# EAGLE design LB_BIT_w6_ARDUINO-v03(4-5)OHW (EAGLE 6.6.0)

## Sheet 1 of 2: micro
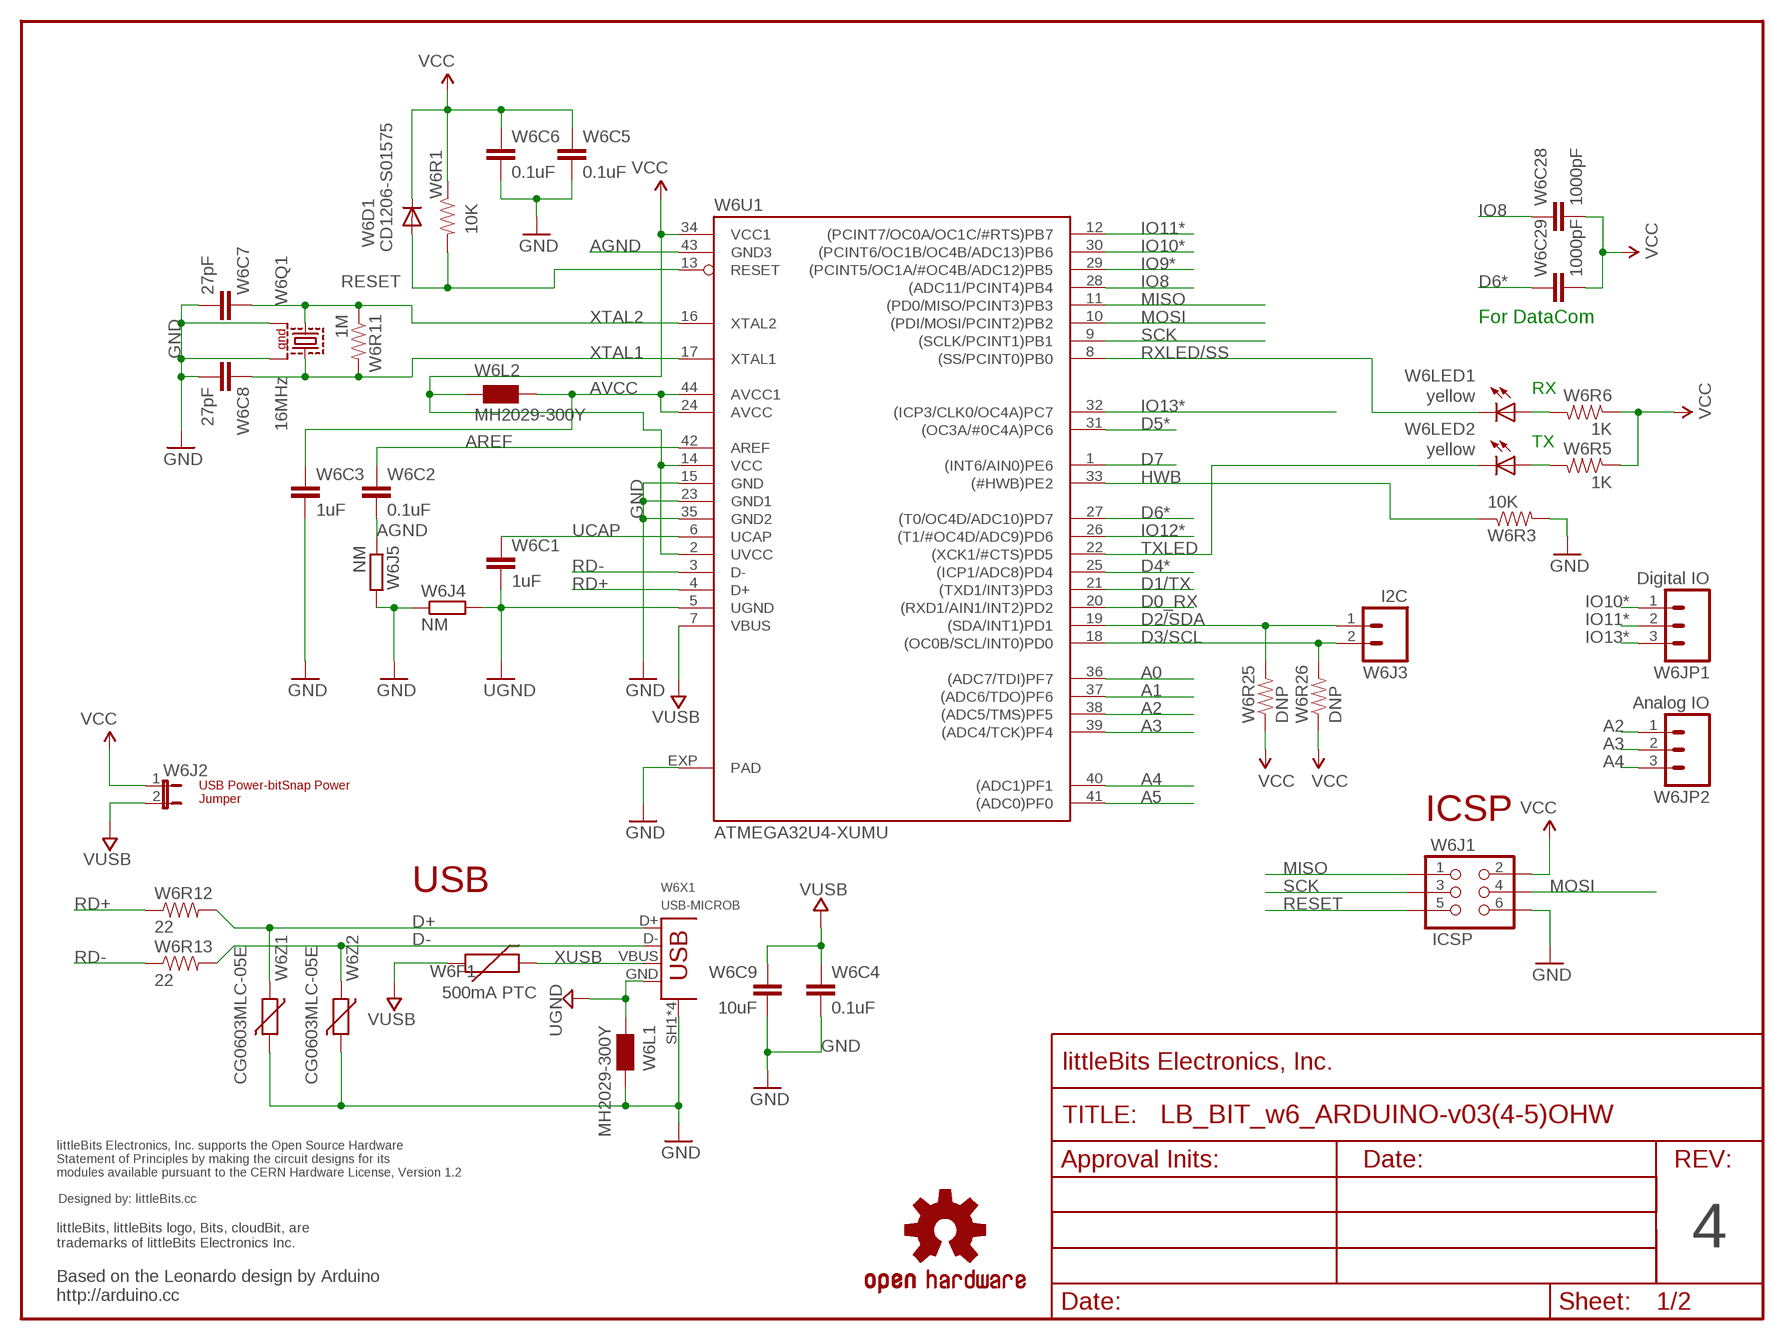
[diagram p0: schematic, sheet 1]

### Parts
FRAME2  FRAME-LETTER-OHWOHW  [FABDWG01-OHW]
U$52  OSHW-LOGOL  [OSHW-LOGO-L]
U$67  OSHWCREDIT  [OSHWCREDIT]
W6C1  1uF  CAPCAP-0603  [CAP-0603]
W6C2  0.1uF  CAPCAP-0603  [CAP-0603]
W6C3  1uF  CAPCAP-0603  [CAP-0603]
W6C4  0.1uF  CAPCAP-0603  [CAP-0603]
W6C5  0.1uF  CAPCAP-0603  [CAP-0603]
W6C6  0.1uF  CAPCAP-0603  [CAP-0603]
W6C7  27pF  CAPCAP-0603  [CAP-0603]
W6C8  27pF  CAPCAP-0603  [CAP-0603]
W6C9  10uF  CAPCAP-0805  [CAP-0805]
W6C28  1000pF  CAPCAP-0603  [CAP-0603]
W6C29  1000pF  CAPCAP-0603  [CAP-0603]
W6D1  CD1206-S01575  DIODE-MINIMELF  [MINIMELF]
W6F1  500mA PTC  PTC  [PTC-1206]
W6J1  ICSP  HDR-2X3  [2X03]
W6J2  JUMPER-2SMD-NO  [SJ_2S-NO]
W6J3  I2C  HDR-20.1IN_NOS.S.  [SIP2-SM-0.1IN]
W6J4  NM  R-EU_R0402  [R0402]
W6J5  NM  R-EU_R0402  [R0402]
W6JP1  Digital IO  M03PTH  [1X03]
W6JP2  Analog IO  M03PTH  [1X03]
W6L1  MH2029-300Y  WE-CBF_0805  [0805]
W6L2  MH2029-300Y  WE-CBF_0805  [0805]
W6LED1  yellow  LED1206  [LED-1206]
W6LED2  yellow  LED1206  [LED-1206]
W6Q1  16MHz  CRYSTAL-SMD-7B-SERIES-TXC  [CRYSTAL-SMD-7B-SERIES-5X3.2MM]
W6R1  10K  RESISTOR0603  [RES-0603]
W6R3  10K  RESISTOR0603  [RES-0603]
W6R5  1K  RESISTOR0603  [RES-0603]
W6R6  1K  RESISTOR0603  [RES-0603]
W6R11  1M  RESISTOR0603  [RES-0603]
W6R12  22  RESISTOR0603  [RES-0603]
W6R13  22  RESISTOR0603  [RES-0603]
W6R25  DNP  RESISTOR0603  [RES-0603]
W6R26  DNP  RESISTOR0603  [RES-0603]
W6U1  ATMEGA32U4-XUMU  [QFN44ML7X7]
W6X1  USB-MICROB  USB-MICROB-DRILLS  [USB-MICROB-AUK-DRILLS]
W6Z1  CG0603MLC-05E  VARISTORCN0603  [CT/CN0603]
W6Z2  CG0603MLC-05E  VARISTORCN0603  [CT/CN0603]

### Nets
A0: W6U1.36((ADC7/TDI)PF7) ; also sheet 2
A1: W6U1.37((ADC6/TDO)PF6) ; also sheet 2
A2: W6JP2.1 W6U1.38((ADC5/TMS)PF5)
A3: W6JP2.2 W6U1.39((ADC4/TCK)PF4)
A4: W6JP2.3 W6U1.40((ADC1)PF1)
A5: W6U1.41((ADC0)PF0)
AGND: W6C2.2 W6J5.1 W6U1.43(GND3)
AREF: W6C2.1 W6U1.42(AREF)
AVCC: W6C3.1 W6L2.2 W6U1.24(AVCC) W6U1.44(AVCC1)
D0_RX: W6U1.20((RXD1/AIN1/INT2)PD2) ; also sheet 2
D1/TX: W6U1.21((TXD1/INT3)PD3) ; also sheet 2
D2/SDA: W6J3.1 W6R25.2 W6U1.19((SDA/INT1)PD1)
D3/SCL: W6J3.2 W6R26.2 W6U1.18((OC0B/SCL/INT0)PD0)
D4*: W6U1.25((ICP1/ADC8)PD4)
D5*: W6U1.31((OC3A/#0C4A)PC6) ; also sheet 2
D6*: W6C29.1 W6U1.27((T0/OC4D/ADC10)PD7)
D7: W6U1.1((INT6/AIN0)PE6)
D+: W6R12.2 W6X1.D+ W6Z1.1
D-: W6R13.2 W6X1.D- W6Z2.1
GND: W6C3.2 W6C4.2 W6C5.2 W6C6.2 W6C7.2 W6C8.2 W6C9.2 W6J1.6 W6J4.1 W6J5.2 W6L1.2 W6Q1.P$2 W6Q1.P$4 W6R3.2 W6U1.15(GND) W6U1.23(GND1) W6U1.35(GND2) W6U1.EXP(PAD) W6X1.SH1(SH) W6X1.SH2(SH) W6X1.SH3(SH) W6X1.SH4(SH) W6Z1.2 W6Z2.2 ; also sheet 2
HWB: W6R3.1 W6U1.33((#HWB)PE2)
IO8: W6C28.1 W6U1.28((ADC11/PCINT4)PB4)
IO9*: W6U1.29((PCINT5/OC1A/#OC4B/ADC12)PB5) ; also sheet 2
IO10*: W6JP1.1 W6U1.30((PCINT6/OC1B/OC4B/ADC13)PB6)
IO11*: W6JP1.2 W6U1.12((PCINT7/OC0A/OC1C/#RTS)PB7)
IO12*: W6U1.26((T1/#OC4D/ADC9)PD6)
IO13*: W6JP1.3 W6U1.32((ICP3/CLK0/OC4A)PC7)
MISO: W6J1.1 W6U1.11((PD0/MISO/PCINT3)PB3)
MOSI: W6J1.4 W6U1.10((PDI/MOSI/PCINT2)PB2)
N$1: W6LED1.A W6R6.2
N$2: W6LED2.A W6R5.2
RD+: W6R12.1 W6U1.4(D+)
RD-: W6R13.1 W6U1.3(D-)
RESET: W6D1.A W6J1.5 W6R1.2 W6U1.13(RESET)
RXLED/SS: W6LED1.C W6U1.8((SS/PCINT0)PB0)
SCK: W6J1.3 W6U1.9((SCLK/PCINT1)PB1)
TXLED: W6LED2.C W6U1.22((XCK1/#CTS)PD5)
UCAP: W6C1.1 W6U1.6(UCAP)
UGND: W6C1.2 W6J4.2 W6L1.1 W6U1.5(UGND) W6X1.GND
VCC: W6C5.1 W6C6.1 W6C28.2 W6C29.2 W6D1.C W6J1.2 W6J2.1 W6L2.1 W6R1.1 W6R5.1 W6R6.1 W6R25.1 W6R26.1 W6U1.2(UVCC) W6U1.14(VCC) W6U1.34(VCC1) ; also sheet 2
VUSB: W6C4.1 W6C9.1 W6F1.1 W6J2.2 W6U1.7(VBUS)
XTAL1: W6C8.1 W6Q1.P$3 W6R11.2 W6U1.17(XTAL1)
XTAL2: W6C7.1 W6Q1.P$1 W6R11.1 W6U1.16(XTAL2)
XUSB: W6F1.2 W6X1.VBUS

### Notes on the sheet
- For DataCom
- RX
- TX
- USB Power-bitSnap Power
  Jumper
- ICSP
- USB
- 4
- Based on the Leonardo design by Arduino
  http://arduino.cc

## Sheet 2 of 2: i/o filters
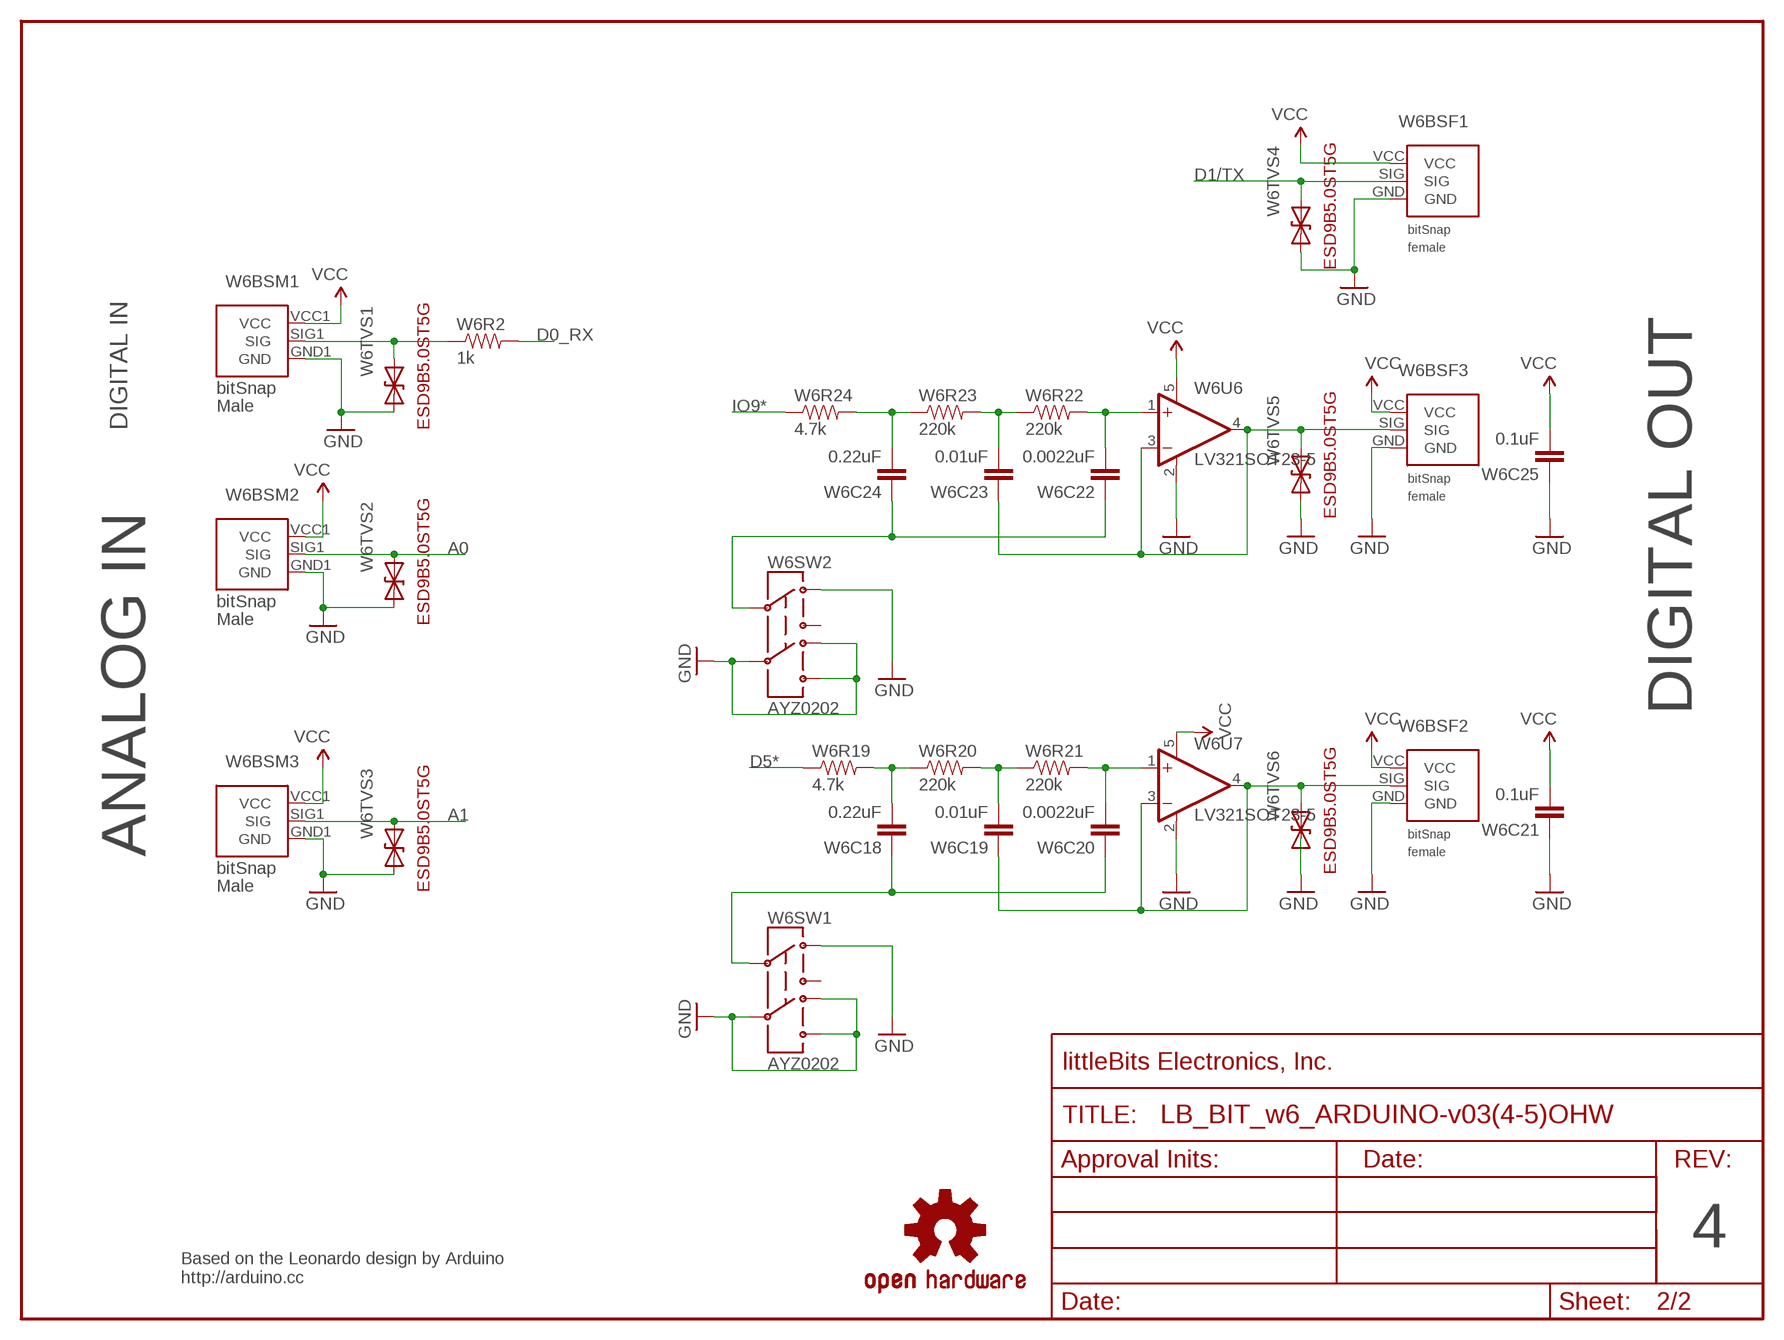
[diagram p1: schematic, sheet 2]

### Parts
U$54  FRAME-LETTER-OHWOHW  [FABDWG01-OHW]
U$70  OSHW-LOGOL  [OSHW-LOGO-L]
W6BSF1  BITSNAP_V03_FEMALE  [BITSNAP_V03_FEMALE]
W6BSF2  BITSNAP_V03_FEMALE  [BITSNAP_V03_FEMALE]
W6BSF3  BITSNAP_V03_FEMALE  [BITSNAP_V03_FEMALE]
W6BSM1  BITSNAP_V03_MALE  [BITSNAP_V03_MALE]
W6BSM2  BITSNAP_V03_MALE  [BITSNAP_V03_MALE]
W6BSM3  BITSNAP_V03_MALE  [BITSNAP_V03_MALE]
W6C18  0.22uF  CAPCAP-0603  [CAP-0603]
W6C19  0.01uF  CAPCAP-0603  [CAP-0603]
W6C20  0.0022uF  CAPCAP-0603  [CAP-0603]
W6C21  0.1uF  CAPCAP-0603  [CAP-0603]
W6C22  0.0022uF  CAPCAP-0603  [CAP-0603]
W6C23  0.01uF  CAPCAP-0603  [CAP-0603]
W6C24  0.22uF  CAPCAP-0603  [CAP-0603]
W6C25  0.1uF  CAPCAP-0603  [CAP-0603]
W6R2  1k  RESISTOR0603  [RES-0603]
W6R19  4.7k  RESISTOR0603  [RES-0603]
W6R20  220k  RESISTOR0603  [RES-0603]
W6R21  220k  RESISTOR0603  [RES-0603]
W6R22  220k  RESISTOR0603  [RES-0603]
W6R23  220k  RESISTOR0603  [RES-0603]
W6R24  4.7k  RESISTOR0603  [RES-0603]
W6SW1  AYZ0202  [AYZ0202]
W6SW2  AYZ0202  [AYZ0202]
W6TVS1  DIODE-TVSSOD-923  [SOD-923]
W6TVS2  DIODE-TVSSOD-923  [SOD-923]
W6TVS3  DIODE-TVSSOD-923  [SOD-923]
W6TVS4  DIODE-TVSSOD-923  [SOD-923]
W6TVS5  DIODE-TVSSOD-923  [SOD-923]
W6TVS6  DIODE-TVSSOD-923  [SOD-923]
W6U6  LV321SOT23-5  [SOT23-5]
W6U7  LV321SOT23-5  [SOT23-5]

### Nets
A0: W6BSM2.SIG1(SIG) W6TVS2.2(C) ; also sheet 1
A1: W6BSM3.SIG1(SIG) W6TVS3.2(C) ; also sheet 1
D0_RX: W6R2.2 ; also sheet 1
D1/TX: W6BSF1.SIG W6TVS4.2(C) ; also sheet 1
D5*: W6R19.1 ; also sheet 1
GND: W6BSF1.GND W6BSF2.GND W6BSF3.GND W6BSM1.GND1(GND) W6BSM2.GND1(GND) W6BSM3.GND1(GND) W6C21.1 W6C25.1 W6SW1.1 W6SW1.4 W6SW1.5 W6SW1.6 W6SW2.1 W6SW2.4 W6SW2.5 W6SW2.6 W6TVS1.1(A) W6TVS2.1(A) W6TVS3.1(A) W6TVS4.1(A) W6TVS5.1(A) W6TVS6.1(A) W6U6.2(V-) W6U7.2(V-) ; also sheet 1
IO9*: W6R24.1 ; also sheet 1
N$3: W6C18.1 W6C20.1 W6SW1.2
N$4: W6BSM1.SIG1(SIG) W6R2.1 W6TVS1.2(C)
N$13: W6C18.2 W6R19.2 W6R20.1
N$14: W6C19.2 W6R20.2 W6R21.1
N$15: W6C20.2 W6R21.2 W6U7.1(+IN)
N$16: W6BSF2.SIG W6C19.1 W6TVS6.2(C) W6U7.3(-IN) W6U7.4(OUT)
N$17: W6BSF3.SIG W6C23.1 W6TVS5.2(C) W6U6.3(-IN) W6U6.4(OUT)
N$18: W6C22.2 W6R22.2 W6U6.1(+IN)
N$19: W6C24.2 W6R23.1 W6R24.2
N$20: W6C23.2 W6R22.1 W6R23.2
N$23: W6C22.1 W6C24.1 W6SW2.2
VCC: W6BSF1.VCC W6BSF2.VCC W6BSF3.VCC W6BSM1.VCC1(VCC) W6BSM2.VCC1(VCC) W6BSM3.VCC1(VCC) W6C21.2 W6C25.2 W6U6.5(V+) W6U7.5(V+) ; also sheet 1
Unconnected: W6SW1.3 W6SW2.3

### Notes on the sheet
- DIGITAL IN
- DIGITAL OUT
- ANALOG IN
- 4
- Based on the Leonardo design by Arduino
  http://arduino.cc

## Library data of the parts
FRAME2 U$54 = LITTLEBITS:FRAME-LETTER-OHW
U$52 U$70 = LITTLEBITS:OSHW-LOGO: Open Source Hardware Logo This logo indicates the piece of hardware it is found on incorporates a OSHW license and/or adheres to the definition of open source hardware found here: http://freedomdefined.org/OSHW
U$67 = LITTLEBITS:OSHWCREDIT
W6BSF1-W6BSF3 = bitSnap:BITSNAP_V03_FEMALE
W6BSM1-W6BSM3 = bitSnap:BITSNAP_V03_MALE
W6C1-W6C9 W6C18-W6C25 W6C28 W6C29 = LITTLEBITS:CAP
W6D1 = diode:DIODE-: DIODE
W6F1 = LITTLEBITS:PTC
W6J1 = LITTLEBITS:HDR-2X3
W6J2 = LITTLEBITS:JUMPER-2: Jumper Basic 0.1" spaced jumper. Use with breakaway headers.
W6J3 = LITTLEBITS:HDR-2
W6J4 W6J5 = SmartPrj:R-EU_: RESISTOR, European symbol
W6JP1 W6JP2 = SparkFun:M03: Header 3 Standard 3-pin 0.1" header. Use with straight break away headers (SKU : PRT-00116), right angle break away headers (PRT-00553), swiss pins (PRT-00743), machine pins (PRT-00117), and female headers (PRT-00115). Molex polarized connector foot print use with SKU : PRT-08232 with associated crimp pins and housings.
W6L1 W6L2 = wuerth-elektronik:WE-CBF: SMD EMI Suppression Ferrite Beads - excellent anti-EMI properties - low DCR - impedances till 3000 ohms - rated current up to 6 A
W6LED1 W6LED2 = LITTLEBITS:LED
W6Q1 = LITTLEBITS:CRYSTAL-SMD-7B-SERIES-TXC; MFG: TXC; MPN: 7B SERIES
W6R1-W6R3 W6R5 W6R6 W6R11-W6R13 W6R19-W6R26 = LITTLEBITS:RESISTOR
W6SW1 W6SW2 = LITTLEBITS:AYZ0202
W6TVS1-W6TVS6 = LITTLEBITS:DIODE-TVS: Bidirectional Transient Voltage Suppression Diode: Device conducts in avalanche mode after reaching a part dependent voltage threshold. Used for limiting voltage spikes on ESD sensitive inputs and outputs.; IEC_ESD_PROT0: +/-18kV; LB_PN: ?; MPN: ESD9B5.0ST5G; V_CLAMP: ?; V_OPERATION: 5V
W6U1 = SmartPrj:ATMEGA32U4-XU
W6U6 W6U7 = LITTLEBITS:LV321
W6X1 = LITTLEBITS:USB-MICROB-DRILLS: AUK micro USB connector Part #: MCSB5ABSW-4-GXX-R1K-H; MFG: AUK; MPN: MCSB5ABSW-4-GXX-R1K-H
W6Z1 W6Z2 = varistor:VARISTOR: VARISTOR

## Net classes
0 default: width 0.254 mm, drill 0.61 mm, clearance 0.203 mm
1 vcc: width 0.254 mm

## Board
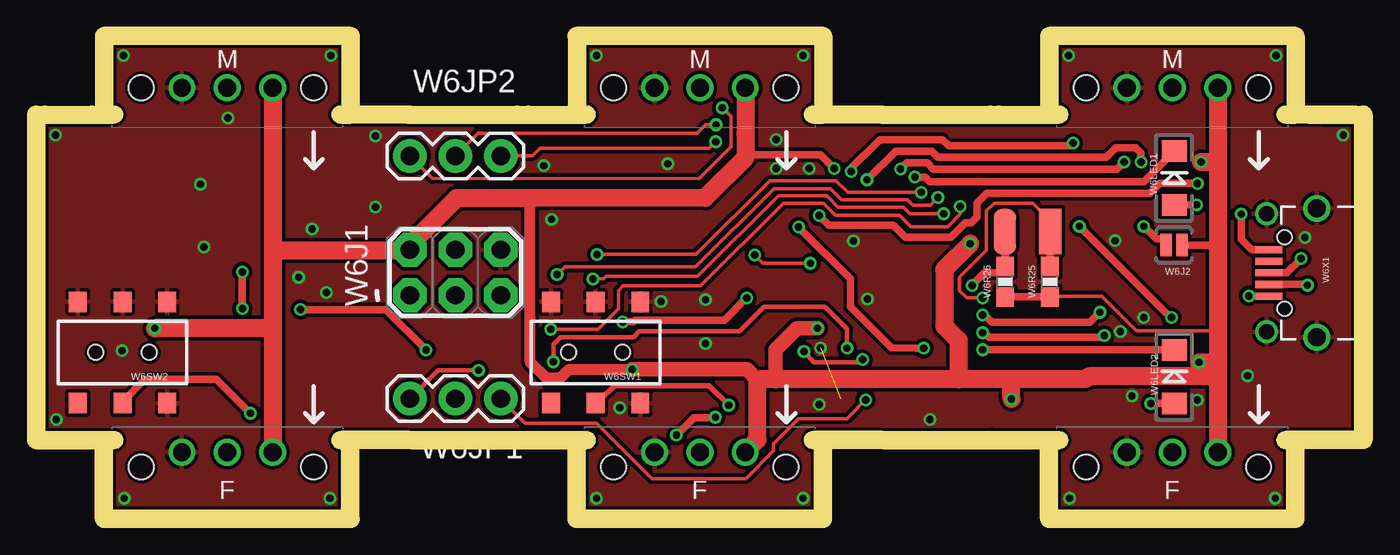
[diagram p2: board, top side]
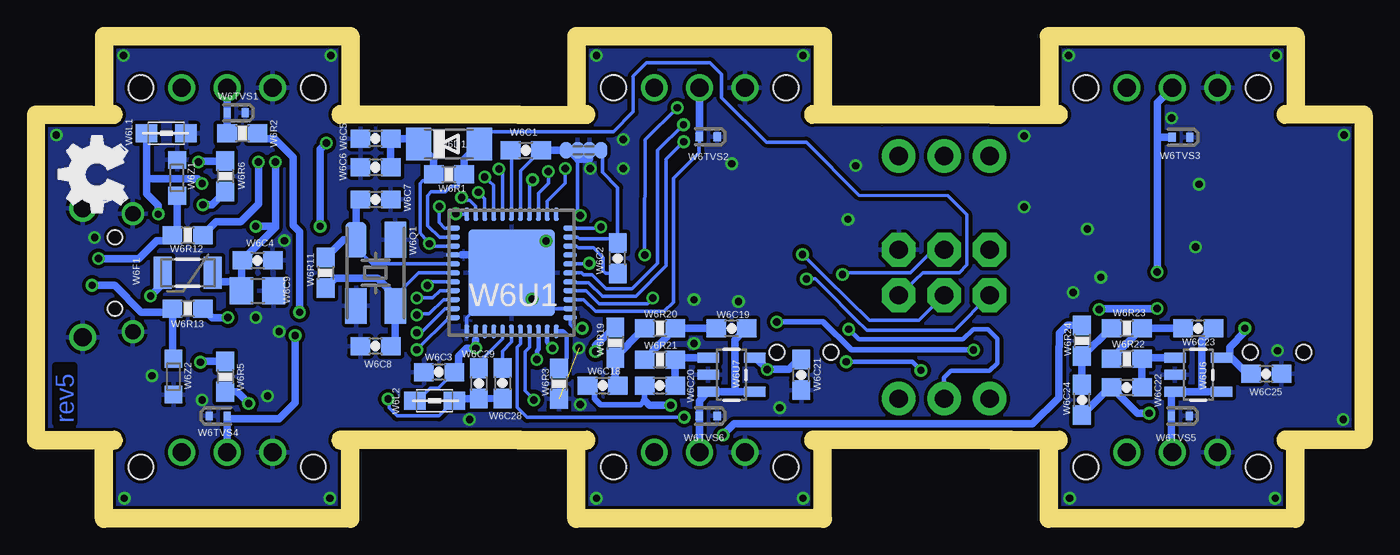
[diagram p3: board, bottom side, seen from below]

Size 73.25 x 26 mm. Coordinates in mm from the lower left corner, seen from the top.
Outline: 0,21.6 0,4.4 0.05,4.4
Outline: 73.25,4.4 73.25,21.6 71.45,21.6
Outline: 19.15,4.4 28.82,4.4
Outline: 46.6,4.4 53,4.4
Outline: 46.75,21.6 53.05,21.6
Outline: 20.35,21.6 26.45,21.6
Copper layers (1*16): Top 0.035mm / dielectric 1.5mm / Bottom 0.035mm
Design rules "littleBitsDRC": minimum track width 0.2mm, minimum drill 0.4mm, track to track 0.2mm, track to pad 0.2mm, pad to pad 0.2mm, via to via 0.2mm, smd to smd 0mil, copper to edge 0.2mm, drill to drill 0.2mm, minimum pad ring 0.2mm, minimum via ring 0.15mm, stop-mask expansion 0.1mm, vias tented up to drill 0mil, thermal gap 0.2mm
Milling: 10 lines

### Footprints (pad centres in the part's own frame; a part is rotated, then mirrored left to right if it is on the bottom)
BITSNAP_V03_FEMALE = drill 1: GND 4.065,3.44; SIG 6.605,3.44; VCC 9.145,3.44 | hole 1.4: 1.785,2.61; 11.425,2.61
BITSNAP_V03_MALE = drill 1: GND1 9.145,2.61; SIG1 6.605,2.61; VCC1 4.065,2.61 | hole 1.4: 1.785,2.61; 11.425,2.61
CAP-0603 = smd 1.1 x 1: 1 -0.85,0; 2 0.85,0
CAP-0805 = smd 1.3 x 1.5: 1 -0.9,0; 2 0.9,0
MINIMELF = smd 1.4 x 1.8: A 1.7,0; C -1.7,0
PTC-1206 = smd 1 x 1.8: 1 -1.4,0; 2 1.4,0
2X03 = drill 1.016 pad 1.88 octagon: 1 0,5.08; 2 2.54,5.08; 3 0,2.54; 4 2.54,2.54; 5 0,0; 6 2.54,0
SJ_2S-NO = smd 0.635 x 1.27: 1 -0.45,0; 2 0.45,0
SIP2-SM-0.1IN = smd 1.27 x 2.54: 1 -1.27,0; 2 1.27,0
R0402 = smd 0.7 x 0.9: 1 -0.65,0; 2 0.65,0
1X03 = drill 1.016 pad 1.88: 1 0,0; 2 2.54,0; 3 5.08,0
0805 = smd 1.2 x 1: 1 -1.1,0; 2 1.1,0
LED-1206 = smd 1.2 x 1.4: A -1.5,0; C 1.5,0
CRYSTAL-SMD-7B-SERIES-5X3.2MM = smd 2 x 1.2: P$1 -1.85,-1.1; P$2 1.85,-1.1; P$3 1.85,1.1; P$4 -1.85,1.1
RES-0603 = smd 1.1 x 1: 1 -0.85,0; 2 0.85,0
AYZ0202 = smd 1 x 1.15: 1 -2.5,2.825; 2 0,2.825; 3 2.5,2.825; 4 -2.5,-2.825; 5 0,-2.825; 6 2.5,-2.825 | hole 0.85: 1.5,0; -1.5,0
SOD-923 = smd 0.4 x 0.5: 1 -0.5,0; 2 0.5,0
QFN44ML7X7 = smd 0.75 x 0.275: 1 -3.275,2.5; 2 -3.275,2; 3 -3.275,1.5; 4 -3.275,1; 5 -3.275,0.5; 6 -3.275,0; 7 -3.275,-0.5; 8 -3.275,-1; 9 -3.275,-1.5; 10 -3.275,-2; 11 -3.275,-2.5; 23 3.275,-2.5; 24 3.275,-2; 25 3.275,-1.5; 26 3.275,-1; 27 3.275,-0.5; 28 3.275,0; 29 3.275,0.5; 30 3.275,1; 31 3.275,1.5; 32 3.275,2; 33 3.275,2.5 | smd 0.275 x 0.75: 12 -2.5,-3.275; 13 -2,-3.275; 14 -1.5,-3.275; 15 -1,-3.275; 16 -0.5,-3.275; 17 0,-3.275; 18 0.5,-3.275; 19 1,-3.275; 20 1.5,-3.275; 21 2,-3.275; 22 2.5,-3.275; 34 2.5,3.275; 35 2,3.275; 36 1.5,3.275; 37 1,3.275; 38 0.5,3.275; 39 0,3.275; 40 -0.5,3.275; 41 -1,3.275; 42 -1.5,3.275; 43 -2,3.275; 44 -2.5,3.275 | smd 4.826 x 4.826: EXP 0,0
SOT23-5 = smd 0.55 x 1.2: 1 -0.95,-1.3; 2 0,-1.3; 3 0.95,-1.3; 4 0.95,1.3; 5 -0.95,1.3
USB-MICROB-AUK-DRILLS = smd 0.4 x 1.5: D+ 0,2.67; D- -0.65,2.67; GND 1.3,2.67; ID 0.65,2.67; VBUS -1.3,2.67 | drill 0.85: SH1 -3.3,2.8; SH2 3.3,2.8 | drill 1: SH3 -3.6,0; SH4 3.6,0 | hole 0.8: -2,1.8; 2,1.8
CT/CN0603 = smd 1 x 1: 1 -1,0; 2 1,0

### Placement (x,y rotation side)
DRILEGEND  [DRILEGEND]  15.03,-26.27 0 top  (outside the outline)
FRAME2  29.05,-9.25 0 top  (outside the outline)
U$5  [OSHW_FILLX150_NOTEXT]  68.65,15.8 0 top
U$29  [-]  18.34,12.4 270 top
U$52  3.8,-80.25 0 top  (outside the outline)
U$54  29.05,-9.25 0 top  (outside the outline)
U$67  -58.9,-63.1 0 top  (outside the outline)
U$70  3.8,-80.25 0 top  (outside the outline)
W6BSF1  56.45,-0.21 0 top
W6BSF2  30.03,-0.21 0 top
W6BSF3  3.61,-0.21 0 top
W6BSM1  69.66,26.21 180 top
W6BSM2  43.23,26.21 180 top
W6BSM3  16.82,26.21 180 top
W6C1  46.35,20.1 0 bottom
W6C2  41.21,14.06 90 bottom
W6C3  51.2,7.7 180 bottom
W6C4  61.35,13.95 0 bottom
W6C5  54.75,20.75 180 bottom
W6C6  54.75,19.15 180 bottom
W6C7  54.75,17.35 0 bottom
W6C8  54.75,9.15 180 bottom
W6C9  61.35,12.25 0 bottom
W6C18  42.05,6.95 0 bottom
W6C19  34.85,10.15 180 bottom
W6C20  38.85,6.95 0 bottom
W6C21  30.95,7.55 90 bottom
W6C22  12.75,6.85 0 bottom
W6C23  8.75,10.15 180 bottom
W6C24  15.25,6.15 90 bottom
W6C25  4.95,7.6 180 bottom
W6C28  47.66,7.08 270 bottom
W6C29  48.98,7.07 270 bottom
W6D1  50.65,20.45 0 bottom
W6F1  65.25,13.25 180 bottom
W6J1  25.5,12 90 top
W6J2  63.15,14.8 180 top
W6J3  54.95,15.55 180 top
W6J4  43.45,20.1 180 bottom
W6J5  42.8,20.1 180 bottom
W6JP1  25.5,6.22 180 top
W6JP2  25.5,19.78 180 top
W6L1  66.45,21.05 0 bottom
W6L2  51.45,6.1 180 bottom
W6LED1  63.15,18.55 90 top
W6LED2  63.15,7.45 90 top
W6Q1  54.75,13.25 270 bottom
W6R1  50.65,18.75 0 bottom
W6R2  62.2,21.05 0 bottom
W6R3  44.5,7.06 270 bottom
W6R5  63.15,7.45 270 bottom
W6R6  63.15,18.65 270 bottom
W6R11  57.55,13.25 270 bottom
W6R12  65.25,15.35 180 bottom
W6R13  65.25,11.25 180 bottom
W6R19  41.35,9.35 270 bottom
W6R20  38.85,10.15 0 bottom
W6R21  38.85,8.4 0 bottom
W6R22  12.75,8.45 0 bottom
W6R23  12.75,10.15 0 bottom
W6R24  15.25,9.45 270 bottom
W6R25  56.2,12.75 90 top
W6R26  53.7,12.75 90 top
W6SW1  30.8,8.8 180 top
W6SW2  4.35,8.8 180 top
W6TVS1  62.55,22.19 180 bottom
W6TVS2  36.15,20.86 180 bottom
W6TVS3  9.72,20.82 180 bottom
W6TVS4  63.55,5.25 0 bottom
W6TVS5  9.75,5.25 180 bottom
W6TVS6  36.15,5.25 180 bottom
W6U1  47.15,13.25 270 bottom
W6U6  8.75,7.55 270 bottom
W6U7  34.85,7.55 270 bottom
W6X1  71.12,13.25 90 top
W6Z1  65.85,18.56 90 bottom
W6Z2  66.05,7.45 270 bottom

### Tracks (layer width: path | path; a pad name or v marks a point on that pad's centre or on a via)
A0
  Bottom 0.203: W6U1.36 43.11,11.75 42.45,11.09 38.61,11.09 38.08,11.62 38.09,18.54 36.66,19.97 W6TVS2.2
  Bottom 0.406: W6TVS2.2 36.65,23.58 W6BSM2.SIG1
A1  (via drill 0.41)
  Top 0.406: v39.25,11.85 38.01,10.61 33.01,10.61 32.91,10.51 v32.32,10.51 | v11.05,11.25 v11.05,13.3 | v14.3,11.2 19.05,11.2 v21.32,8.94
  Bottom 0.203: W6U1.37 42.98,12.25 42.25,11.52 39.55,11.52 v39.25,11.85
  Bottom 0.305: v32.32,10.51 29.75,10.51 28.13,8.94 v21.32,8.94 21.3,8.95
  Bottom 0.406: v11.05,11.25 14.25,11.25 v14.3,11.2 | v11.05,13.3 11.05,20.81 | 11.05,20.81 11.05,22.76 W6BSM3.SIG1 | W6TVS3.2 11.04,20.82 11.05,20.81
A2  (via drill 0.41)
  Top 0.203: v37.52,20.58 37.15,20.21 27.69,20.2 27.29,19.8 25.52,19.8 W6JP2.1
  Bottom 0.203: W6U1.38 43.88,12.71 42.84,12.71 42.07,11.94 40.19,11.94 38.5,13.64 38.5,19.61 v37.52,20.58
A3  (via drill 0.41)
  Top 0.203: v37.53,21.53 36.95,21.53 36.46,21.04 24.22,21.04 W6JP2.2
  Bottom 0.203: W6U1.39 43.24,13.25 43.12,13.13 42.64,13.13 41.86,12.35 40.41,12.35 38.98,13.79 38.98,20.09 v37.53,21.53
A4  (via drill 0.41)
  Top 0.203: v42.81,13.79 40.15,13.79 v39.7,14.24 | v37.88,22.48 v37.88,22.47 38.36,22 38.36,20.29 36.58,18.51 21.68,18.53 21.64,18.56 W6JP2.3
  Bottom 0.203: W6U1.40 42.84,13.75 v42.81,13.79 | v39.7,14.24 39.68,20.7 v37.88,22.48
AGND
  Bottom 0.203: 42.2,20.05 W6J5.1 42.05,20 42.05,18.86 41.21,18.02 41.21,15.15 | 41.23,15.22 41.21,15.15 | 41.21,15.15 W6C2.2 | W6U1.43 43.45,15.25 43.35,15.15 41.21,15.15
AREF
  Bottom 0.203: W6C2.1 41.88,13.22 42.02,13.36 42.02,14.1 42.57,14.65 43.4,14.65 43.5,14.75 W6U1.42
AVCC  (via drill 0.41)
  Top 0.406: 48.72,9.04 v49.14,9.04 47.35,9.05 45.05,11.35 45.05,12.92 v42.15,15.81
  Bottom 0.203: W6U1.44 42.28,15.75 v42.15,15.81 | 49.15,9.5 W6U1.24 | 52.4,6.1 51.7,6.8 51.25,6.8 W6C3.1
  Bottom 0.406: W6C3.1 50.1,8 50.1,8.6 49.66,9.04 49.26,9.04 | 49.26,9.04 v49.14,9.04 | 49.15,9.5 49.15,9.15 49.26,9.04 | 52.4,6.1 W6L2.2
D0_RX  (via drill 0.41)
  Top 0.406: 58.85,10.9 v59,11.05 58.45,10.5 52.95,10.5 52.55,10.9 v52.45,10.9
  Bottom 0.203: W6U1.20 50.95,11.75 51.75,10.95 52.4,10.95 v52.45,10.9
  Bottom 0.406: v59,11.05 59,15.55 59.35,15.9 59.35,19.7 60.4,20.75 61.05,20.75 W6R2.2
D1/TX  (via drill 0.41)
  Top 0.406: v52.45,9.9 52.55,9.9 52.8,9.65 59.15,9.65 v59.25,9.75
  Bottom 0.203: v52.45,9.9 52.2,9.9 50.85,11.25 W6U1.21
  Bottom 0.406: W6BSF1.SIG W6TVS4.2 63,5.1 60.15,5.1 59.25,6 v59.25,9.75
D2/SDA  (via drill 0.41)
  Top 0.203: v52.45,11.85 51.55,11.85 51.15,12.25 51.15,13 52.65,14.5 52.65,16.71 53.09,17.15 55.25,17.15 56.2,16.2 56.2,15.57 W6J3.1 | 56.25,15.63 W6J3.1 | 56.2,15.58 W6J3.1
  Top 0.406: W6R25.2 56.2,15.58
  Bottom 0.203: 52.35,11.75 v52.45,11.85 51.55,11.85 51.15,12.25 W6U1.19
D3/SCL  (via drill 0.41)
  Top 0.406: W6J3.2 53.7,15.53 W6R26.2 53.7,13.55 53.7,13.45 53.5,13.25 52.55,13.25 v51.85,12.55
  Bottom 0.203: W6U1.18 51.85,12.75 v51.85,12.55
D5*  (via drill 0.41)
  Top 0.254: v42.45,8.85 43,8.25 45.65,8.25 45.78,8.38 v45.73,8.4
  Bottom 0.254: W6U1.31 45.65,8.97 45.73,8.89 v45.73,8.4
  Bottom 0.406: 41.4,10.2 41.4,10.25 W6R19.1 42.45,9.2 v42.45,8.85
D6*
  Bottom 0.203: W6U1.27 47.65,9.58 48.69,8.54 48.69,8.21 W6C29.1
D+  (via drill 0.41)
  Top 0.406: W6X1.D+ 69.45,13.25 v70.25,14.05
  Bottom 0.406: W6Z1.1 65.85,15.35 W6R12.2 66.4,15.05 67,15.05 68,14.05 v70.25,14.05
D-  (via drill 0.41)
  Top 0.406: W6X1.D- 70.62,12.6 v70.6,12.56
  Bottom 0.406: W6Z2.1 66.1,8.5 W6R13.2 66.1,11.2 66.25,11.05 67.85,11.06 69.35,12.57 v70.6,12.56
GND  (via drill 0.41)  (1 unrouted)
  Bottom 0.2: 45.46,11.25 v46,11.79
  Bottom 0.203: W6U1.15 49.95,14.25 | W6U1.23 49.65,10.75 W6U1.EXP | W6U1.35 45.46,11.25
  Bottom 0.406: W6J5.2 43.45,19.6 42.8,19.6 W6J4.1 | 49.95,14.25 48.15,14.25 W6U1.EXP
  other vias: 42.74,19.08 40.9,19.08 30.85,25.4 42.4,25.4 34.84,19.35 40.9,20.7 57.25,25.4 68.85,25.4 4.4,25.4 16,25.4 4.45,0.65 15.95,0.65 30.85,0.65 42.4,0.65 57.3,0.65 68.8,0.65 61.45,10.75 59.85,15.05 28.34,16.24 27.91,19.24 14.2,13 8.7,18.2 0.6,20.95 0.65,5.05 18.49,20.9 60.14,9.97 64.45,6.15 67.25,7.5 70.46,15.22 36.95,11.75 49.5,5.05 60.79,6.36 72.6,20.95 18.49,16.93 14.95,15.7 10.25,21.9 34.46,11.65 15.75,12.15 43.38,9.05 8.9,14.7 4.32,8.9 43.3,5.89 32.15,5.71 45.22,15.03 36.95,9.3
  pour Top: -0.95,-0.25 -0.95,26.11 74.02,26.11 73.81,-0.25
  pour Bottom: -0.95,-0.25 -0.95,26.11 74.02,26.11 73.92,-0.25
HWB
  Bottom 0.254: W6U1.33 44.26,9.98 44.08,9.8 44.08,8.48 W6R3.1
IO8
  Bottom 0.203: W6U1.28 47.15,9.39 47.66,8.88 W6C28.1
IO9*  (via drill 0.41)
  Top 0.406: v37.5,5.18 37.48,5.16 36.3,5.16 v35.32,4.18
  Bottom 0.2: W6U1.29 46.65,9.3 46.85,9.1 46.85,5.75 46.27,5.17
  Bottom 0.203: v37.5,5.18 46.27,5.17
  Bottom 0.406: 15.3,10.25 W6R24.1 | 15.45,10.1 W6R24.1 | v35.32,4.18 v35.32,4.19 34.72,4.81 18.02,4.82 16.54,6.28 16.54,9.13 16.53,9.14 16.53,9.86 16.08,10.31 W6R24.1
IO10*  (via drill 0.41)
  Top 0.203: v45.9,6.15 44.85,5.1 42.15,5.1 40.75,3.7 40.75,3.3 39.2,1.75 33.95,1.75 30.85,4.85 26.87,4.85 W6JP1.1
  Bottom 0.2: W6U1.30 46.15,9.1 46.4,8.85 46.4,6.65 v45.9,6.15
IO11*  (via drill 0.41)
  Top 0.203: v51.18,16.96 51.18,16.53 50.49,15.84 48.44,15.84 47.8,16.48 44.21,16.48 43.54,17.14 41.3,17.14 36.66,12.52 32.34,12.52 32.08,12.26 32.08,11.24 30.94,10.1 v28.3,10.1
  Bottom 0.203: W6U1.12 50.89,15.75 51.21,16.07 51.21,16.7 v51.18,16.96
  Bottom 0.254: v28.3,10.1 27.73,9.53 21.9,9.54 21.33,10.11 20.52,10.11 19.99,9.58 19.99,8.21 20.42,7.78 22.57,7.78 22.97,7.38 W6JP1.2
IO13*  (via drill 0.41)
  Top 0.254: v44.86,9.04 44.86,10.12 43.63,11.35 40.23,11.35 38.86,9.99 33.24,9.99 32.91,9.65 28.84,9.65 28.44,9.25 v28.44,8.28 | v24.26,7.8 22,7.8 W6JP1.3
  Bottom 0.254: W6U1.32 45.15,9.38 v44.86,9.04 | v28.44,8.28 24.74,8.28 v24.26,7.8
MISO  (via drill 0.41)
  Top 0.203: v50.26,16.55 48.38,16.55 48,16.92 44.36,16.92 43.74,17.55 41.03,17.55 36.51,13.05 31.39,13.05 31.25,12.91 v30.66,12.91
  Bottom 0.203: W6U1.11 50.25,16.52 v50.26,16.55 | v30.66,12.91 30.16,12.91 29.63,12.38 27.91,10.67 27.29,10.05 22.37,10.05 W6J1.1
MOSI  (via drill 0.41)
  Top 0.203: v49.94,17.46 49.52,17.04 48.55,17.04 48.25,17.34 44.55,17.34 43.94,17.96 40.78,17.96 36.4,13.59 30.05,13.58 29.08,13.58 v28.65,13.15
  Bottom 0.203: 49.85,17.38 v49.94,17.46 49.78,17.3 49.49,17.3 49.15,16.96 W6U1.10 49.15,16.84 | v28.65,13.15 28.55,13.25 24.85,13.25 23.55,14.55 W6J1.4
N$1  (via drill 0.41)
  Top 0.406: W6LED1.A v64.4,17.05
  Bottom 0.406: v64.4,17.05 63.9,17.05 W6R6.2
N$2  (via drill 0.41)
  Top 0.406: v61.85,5.95 W6LED2.A
  Bottom 0.406: W6R5.2 62.5,6.6 v61.85,5.95
N$3  (via drill 0.41)
  Top 0.305: 31.05,6.15 31.85,6.95 37.15,6.95 v38.25,5.85
  Top 0.406: W6SW1.2 31.05,6.15 | v38.25,5.84 v38.25,5.85
  Bottom 0.305: W6C20.1 39.7,6.14 39.95,5.89 42.17,5.89 42.5,6.22 42.5,6.95 W6C18.1
  Bottom 0.406: v38.25,5.85 39.42,5.86 39.7,6.14
N$4
  Bottom 0.406: W6R2.1 W6TVS1.2 W6BSM1.SIG1
N$13
  Bottom 0.406: W6R19.2 41.35,7 W6C18.2 | W6R19.2 41.35,8.65 | W6R20.1 39.85,10.05 W6R19.2
N$14
  Bottom 0.406: W6R21.1 W6R20.2 W6C19.2
N$15
  Bottom 0.406: W6U7.1 37.95,8.5 W6R21.2 W6C20.2
N$16
  Bottom 0.406: W6U7.4 34.75,6.6 | 34.75,6.6 W6U7.3 36.65,6.1 W6TVS6.2 36.63,5.23 W6BSF2.SIG | 34,10.1 W6C19.1 34.65,9.5 34.65,6.8 34.75,6.6
N$17
  Bottom 0.406: W6BSF3.SIG 10.25,3.27 W6TVS5.2 10.25,6.4 W6U6.3 8.55,6.6 | W6U6.4 8.55,6.6 | 7.9,10.1 W6C23.1 8.55,9.5 8.55,6.6
N$18
  Bottom 0.406: W6U6.1 11.85,8.5 W6R22.2 W6C22.2
N$19
  Bottom 0.406: W6R23.1 W6R24.2 W6C24.2
N$20
  Bottom 0.406: W6C23.2 W6R23.2 W6R22.1
N$23  (via drill 0.41)
  Top 0.406: W6SW2.2 4.35,6.05 5.6,7.3 9.6,7.3 v11.5,5.4
  Bottom 0.406: 15.45,5.3 W6C24.1 13.7,6.85 W6C22.1 12.15,5.4 v11.5,5.4
RD+  (via drill 0.41)
  Top 0.406: v61.3,19.45 61.3,19.95 61,20.25 59.9,20.25 59.35,19.7 49.95,19.7 49.6,20.05 47.6,20.05 v45.97,18.45
  Bottom 0.203: W6U1.4 46.15,18.2 v45.97,18.45
  Bottom 0.406: v61.3,19.45 61.3,17.1 62.3,16.1 63.65,16.1 W6R12.1
RD-  (via drill 0.41)
  Top 0.406: v45.09,18.92 44.95,18.95 46.7,20.7 50.2,20.7 50.55,20.35 57.35,20.35 v57.5,20.5 | v63,10.75 62.85,10.75 62.85,10.85 v57.85,15.85
  Bottom 0.203: W6U1.3 45.65,17.7 45.64,17.7 45.09,18.25 v45.09,18.92
  Bottom 0.406: 57.5,20.45 v57.5,20.5 57.85,20.15 v57.85,15.85 | v63,10.75 63.9,10.75 W6R13.1
RESET
  Bottom 0.203: W6U1.13 51.16,15.25 51.85,15.88 51.85,17.57 51.64,17.79 50.84,17.79 50.54,18.1 50.2,18.1 50.12,18.18 50.12,18.42 W6R1.2 | 48.5,21.15 41.45,21.15 40.35,22.25 40.35,24.25 39.6,25 36.05,25 35.4,24.35 35.4,23.05 32.9,20.55 30.67,20.55 27.72,17.6 22.75,17.56 21.7,16.5 21.7,13.7 22.1,13.25 24.15,13.25 W6J1.5
  Bottom 0.406: W6R1.2 49.8,19.6 W6D1.A 48.95,20.7 48.5,21.15
RXLED/SS  (via drill 0.41)
  Top 0.406: v48.65,18.6 49.25,18.6 49.5,18.35 61.45,18.35 W6LED1.C
  Bottom 0.203: W6U1.8 48.15,18.15 v48.65,18.6
SCK  (via drill 0.41)
  Top 0.203: v49,17.75 44.9,17.75 44.25,18.4 40.54,18.4 36.42,14.28 v30.88,14.28
  Bottom 0.203: W6U1.9 48.65,17.4 v49,17.75 | v30.88,14.28 29.55,12.95 27.15,10.6 24.36,10.6 W6J1.3
TXLED  (via drill 0.41)
  Top 0.406: W6LED2.C v52.45,8.95
  Bottom 0.203: W6U1.22 50.65,10.75 v52.45,8.95
UCAP
  Bottom 0.203: W6U1.6 47.15,20.05 W6C1.1
UGND  (via drill 0.41)
  Top 0.406: W6X1.GND 67.49,14.55 66.9,15.14 v66.9,16.53 | v64.45,18.25 62.35,18.25 61.8,17.7 52.69,17.7 52.12,17.13 52.12,16.35 51.82,16.05 51.47,16.05 50.66,15.24 48.13,15.24 47.46,15.91 43.84,15.91 v43.3,16.45
  Bottom 0.203: W6U1.5 46.65,18.95 W6C1.2 | v43.3,16.45 43.45,16.75 43.45,19.45 W6J4.2
  Bottom 0.406: 67.55,18.5 W6L1.1 | v66.9,16.53 66.9,17.02 67.55,17.67 67.55,18.5 | 67.55,18.5 64.7,18.5 v64.45,18.25 | W6C1.2 W6J4.2
VCC  (via drill 0.41)
  Top 0.203: 65.59,10 61.05,10 59.1,11.95 56.25,11.95
  Top 0.406: 12.55,16.95 12.75,16.75 | 12.55,10.15 12.75,9.95 | 65.29,19.45 65.59,19.75 | 65.39,8.25 65.59,8.45 | W6J2.1 65.39,14.8 65.59,14.6 | 54.3,7.35 54.17,7.31 | v44.15,19.08 43.38,19.86 39.49,19.85 39.17,20.17 39.17,21.02 | 56.25,11.95 W6R25.1 W6R26.1
  Top 0.61: 27.14,17.33 27.15,8.24 28.05,7.35 28.8,7.35 29.32,7.86 v32.85,7.85
  Top 0.813: 40.85,7.5 40.85,8.95 42.05,10.15 v43.2,10.15 | v32.85,7.85 39.27,7.85 39.86,7.26
  Top 1: 12.75,14.15 12.75,9.95 W6BSF3.VCC | W6BSM1.VCC1 65.59,19.75 65.59,14.6 65.59,10 65.59,8.45 65.59,7.3 | 65.59,7.3 W6BSF1.VCC | W6BSM3.VCC1 12.75,16.75 12.75,14.15 | 12.75,14.15 13.12,14.52 20.32,14.52 W6J1.2 20.32,14.72 20.35,14.75 | v64.65,19.45 65.29,19.45 | v64.55,8.25 65.39,8.25 | 65.59,7.3 65.43,7.3 65.43,7.47 58.37,7.47 58.21,7.31 54.17,7.31 54.05,7.31 | 54.05,7.31 50.24,7.31 | 50.24,7.31 40.88,7.3 | 40.88,7.3 39.94,7.3 39.86,7.26 39.86,3.93 W6BSF2.VCC | W6BSM2.VCC1 39.17,21.02 39.17,19.67 36.92,17.44 27.18,17.43 | 27.18,17.43 23.02,17.42 20.35,14.75 | 40.85,7.5 40.88,7.3 | v51.75,14.88 50.3,13.44 50.3,10.27 51.09,9.49 51.1,8.5 51.1,7.3 50.24,7.31 | v54.05,6.2 54.05,7.31 | 20.35,14.56 20.35,14.75 | 27.14,17.33 27.18,17.43 | 12.55,10.15 v6.15,10.15
  Bottom 0.203: W6U1.34 43.88,10.38 43.65,10.15 v43.2,10.15 | W6R1.1 51.75,18.4 52.11,18.4 52.27,18.24 52.27,15.48 v51.75,14.88 51.55,14.75 W6U1.14 | W6U1.2 45.15,17.25 44.15,18.25 v44.15,19.08 | W6L2.1 51.2,5.25 53.55,5.25 54,5.7 54,6.15 v54.05,6.2
  Bottom 0.254: 32.32,7.86 32.22,7.87 32.3,7.85
  Bottom 0.406: W6C6.1 W6C5.1 52.75,20.75 W6D1.C 51.5,19.6 W6R1.1 | W6R6.1 64.4,19.5 v64.65,19.45 | W6R5.1 64.4,8.3 v64.55,8.25 | W6C28.2 W6C29.2 50.27,6.21 50.35,6.13 W6L2.1 | W6U7.5 33.45,8.45 v32.85,7.85 | v32.85,7.85 32.3,7.85 31.65,7.85 31.05,8.45 30.95,8.45 W6C21.2 | W6C25.2 6,7.6 6.9,8.5 6.95,8.5 | 6.95,8.5 W6U6.5 | v6.15,10.15 6.15,9.95 7,9.1 7,8.55 6.95,8.5 | 32.32,7.86 v32.85,7.85
  Bottom 0.61: 30.99,8.18 31.03,8.23 W6C21.2
VUSB  (via drill 0.41)
  Top 0.406: 60.25,19.35 v60.35,19.45 59.95,19.05 49.7,19.05 49.35,19.4 48.2,19.4 v47.85,19.05 47.9,19.05 | W6J2.2 62.6,15.15 62.15,15.15 v61.45,15.85
  Bottom 0.203: W6U1.7 47.65,18.85 v47.85,19.05
  Bottom 0.406: W6C9.1 62.25,13.9 W6C4.1 60.35,15.8 60.35,15.85 | W6C9.1 62.25,12.45 62.55,12.75 63.85,12.75 W6F1.1 | W6C9.1 62.25,11.85 | v60.35,19.45 60.35,15.85 | v61.45,15.85 60.35,15.85
XTAL1
  Bottom 0.203: W6U1.17 52.35,13.25 53.65,11.95
  Bottom 0.406: W6C8.1 53.65,9.4 W6Q1.P$3 53.65,11.95 54.65,12.95 57,12.95 W6R11.2
XTAL2
  Bottom 0.203: W6U1.16 54.95,13.75 55.65,14.45 55.65,14.9 W6Q1.P$1
  Bottom 0.406: W6C7.1 55.85,17.1 W6Q1.P$1 56.55,15.1 W6R11.1
XUSB  (via drill 0.41)
  Top 0.406: W6X1.VBUS v67.33,11.96
  Bottom 0.406: v67.33,11.96 67.35,11.95 66.55,12.75 66.55,13.15 W6F1.2

### Text on the board
Bottom: rev5
dxf: a1 | a0 | d0/rx | d3 | d2 | w6 arduino | analog | analog | a4 | a3 | a2 | pwm | pwm | d13 | d11 | d10 | d1/tx | a9~ | d5~ | 5 | Arduino@heart board | Based on tthe Leonardo design by Arduino / http://arduino.cc
DrillLegend: LAYER-STACK
DrillLegend_01-16: 01-16
DrillLegend_01-20: 01-20